# EAGLE design DIYTIL311_Programmer (EAGLE 9.4.2)
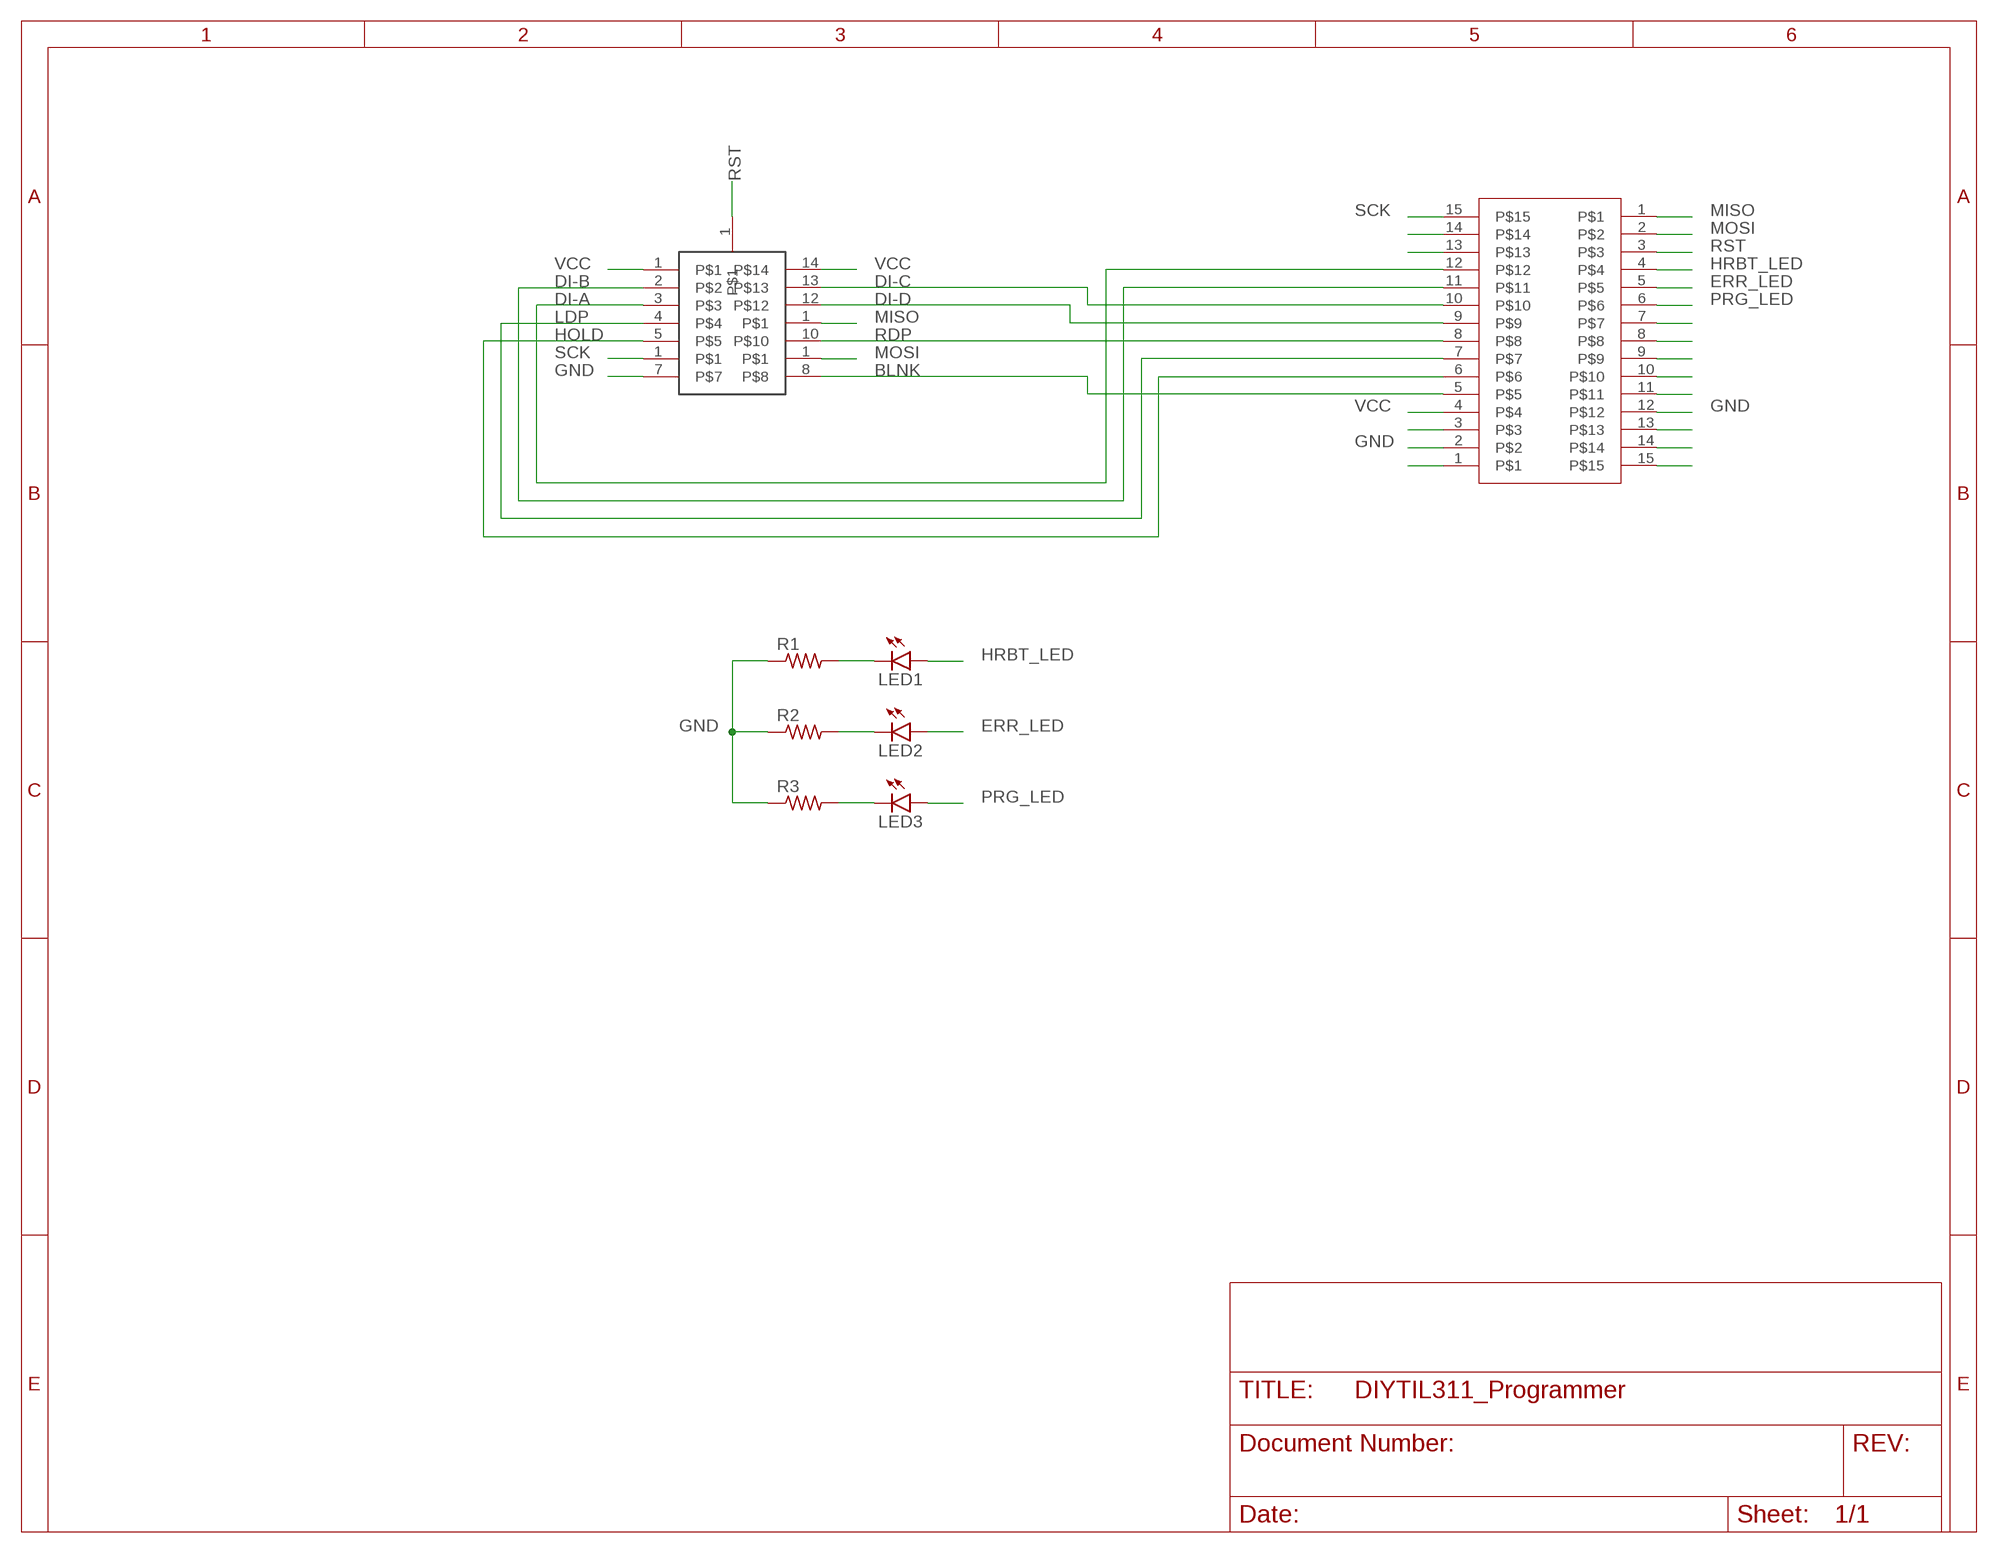
[diagram p0: schematic, sheet 1]

## Parts
LED1  LED5MM  [LED5MM]
LED2  LED5MM  [LED5MM]
LED3  LED5MM  [LED5MM]
MISO  1X1_2.54MM1X1  [1X1_2.54MM_FOOTPRINT]
MOSI  1X1_2.54MM1X1  [1X1_2.54MM_FOOTPRINT]
R1  R-US_0204/7  [0204/7]
R2  R-US_0204/7  [0204/7]
R3  R-US_0204/7  [0204/7]
RST  1X1_2.54MM1X1  [1X1_2.54MM_FOOTPRINT]
SCK  1X1_2.54MM1X1  [1X1_2.54MM_FOOTPRINT]
U$1  TIL311DIP  [TIL311DIP_FOOTPRINT]
U$2  1X15_2.54MM1X15_2.54MM  [1X15_2.54MM_FOOTPRINT]
U$3  1X15_2.54MM1X15_2.54MM  [1X15_2.54MM_FOOTPRINT]

## Nets
BLNK: U$1.8 U$2.5
DI-A: U$1.3 U$2.12
DI-B: U$1.2 U$2.11
DI-C: U$1.13 U$2.10
DI-D: U$1.12 U$2.9
ERR_LED: LED2.A U$3.5
GND: R1.1 R2.1 R3.1 U$1.7 U$2.2 U$3.12
HOLD: U$1.5 U$2.6
HRBT_LED: LED1.A U$3.4
LDP: U$1.4 U$2.7
MISO: MISO.1 U$3.1
MOSI: MOSI.1 U$3.2
N$1: LED1.K(C) R1.2
N$2: LED2.K(C) R2.2
N$4: LED3.K(C) R3.2
N$7: U$3.7
N$8: U$3.8
N$9: U$3.9
N$10: U$3.10
N$11: U$3.11
N$13: U$3.13
N$14: U$3.14
N$15: U$3.15
N$17: U$2.14
N$18: U$2.13
N$28: U$2.3
N$30: U$2.1
PRG_LED: LED3.A U$3.6
RDP: U$1.10 U$2.8
RST: RST.1 U$3.3
SCK: SCK.1 U$2.15
VCC: U$1.1 U$1.14 U$2.4

## Library data of the parts
LED1-LED3 = led:LED: LED OSRAM: - CHIPLED LG R971, LG N971, LY N971, LG Q971, LY Q971, LO R971, LY R971 LH N974, LH R974 LS Q976, LO Q976, LY Q976 LO Q996 - Hyper CHIPLED LW Q18S LB Q993, LB Q99A, LB R99A - SideLED LS A670, LO A670, LY A670, LG A670, LP A670 LB A673, LV A673, LT A673, LW A673 LH A674 LY A675 LS A676, LA A676, LO A676, LY A676, LW A676 LS A679, LY A679, LG A679 - Hyper Micro SIDELED® LS Y876, LA Y876, LO Y876, LY Y876 LT Y87S - SmartLED LW L88C, LW L88S LB L89C, LB L89S, LG L890 LS L89K, LO L89K, LY L89K LS L896, LA L896, LO L896, LY L896 - TOPLED LS T670, LO T670, LY T670, LG T670, LP T670 LSG T670, LSP T670, LSY T670, LOP T670, LYG T670 LG T671, LOG T671, LSG T671 LB T673, LV T673, LT T673, LW T673 LH T674 LS T676, LA T676, LO T676, LY T676, LB T676, LH T676, LSB T676, LW T676 LB T67C, LV T67C, LT T67C, LS T67K, LO T67K, LY T67K, LW E67C LS E67B, LA E67B, LO E67B, LY E67B, LB E67C, LV E67C, LT E67C LW T67C LS T679, LY T679, LG T679 LS T770, LO T770, LY T770, LG T770, LP T770 LB T773, LV T773, LT T773, LW T773 LH T774 LS E675, LA E675, LY E675, LS T675 LS T776, LA T776, LO T776, LY T776, LB T776 LHGB T686 LT T68C, LB T68C - Hyper Mini TOPLED® LB M676 - Mini TOPLED Santana® LG M470 LS M47K, LO M47K, LY M47K Source: http://www.osram.convergy.de LUXEON: - LUMILED® LXK2-PW12-R00, LXK2-PW12-S00, LXK2-PW14-U00, LXK2-PW14-V00 LXK2-PM12-R00, LXK2-PM12-S00, LXK2-PM14-U00 LXK2-PE12-Q00, LXK2-PE12-R00, LXK2-PE12-S00, LXK2-PE14-T00, LXK2-PE14-U00 LXK2-PB12-K00, LXK2-PB12-L00, LXK2-PB12-M00, LXK2-PB14-N00, LXK2-PB14-P00, LXK2-PB14-Q00 LXK2-PR12-L00, LXK2-PR12-M00, LXK2-PR14-Q00, LXK2-PR14-R00 LXK2-PD12-Q00, LXK2-PD12-R00, LXK2-PD12-S00 LXK2-PH12-R00, LXK2-PH12-S00 LXK2-PL12-P00, LXK2-PL12-Q00, LXK2-PL12-R00 Source: www.luxeon.com KINGBRIGHT: KA-3528ASYC Source: www.kingbright.com
MISO MOSI RST SCK = FUCK,_no_one_makes_is_so_I_might_as_well...:1X1_2.54MM
R1-R3 = rcl:R-US_: RESISTOR, American symbol; SPICEPREFIX: R
U$1 = FUCK,_no_one_makes_is_so_I_might_as_well...:TIL311DIP
U$2 U$3 = FUCK,_no_one_makes_is_so_I_might_as_well...:1X15_2.54MM

## Board
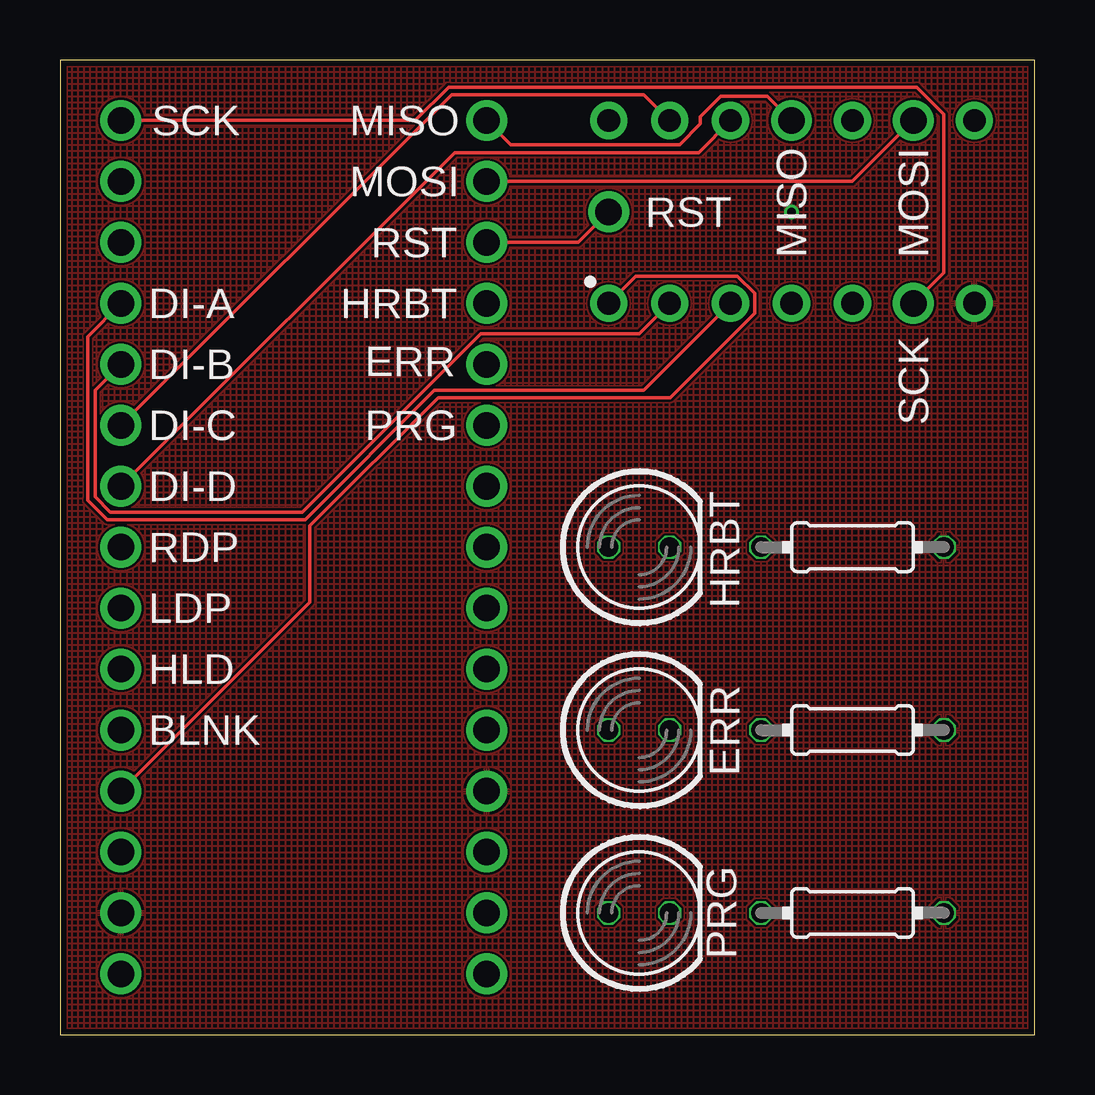
[diagram p1: board, top side]
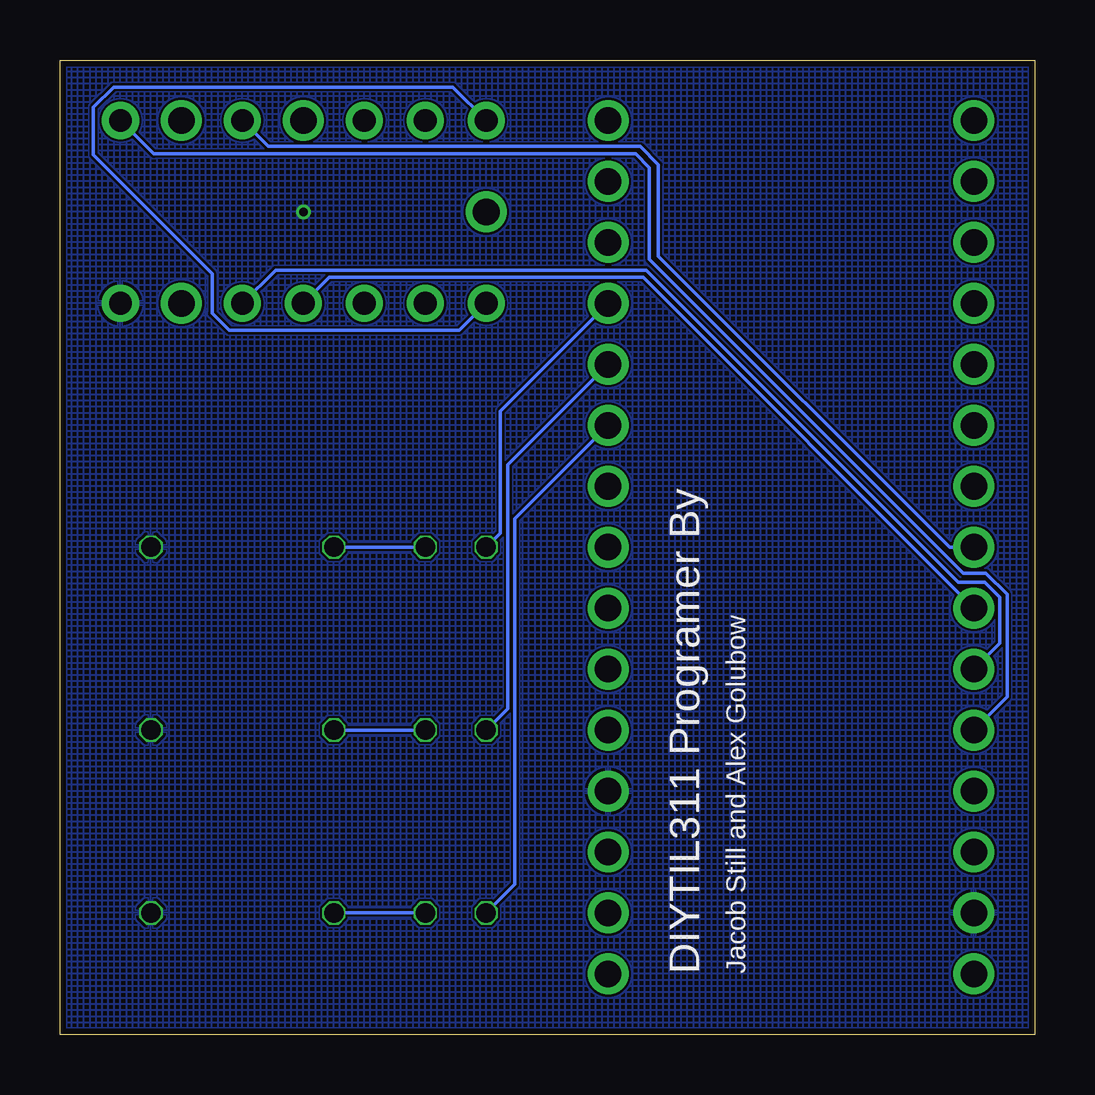
[diagram p2: board, bottom side, seen from below]

Size 40.62 x 40.62 mm. Coordinates in mm from the lower left corner, seen from the top.
Outline: 0,0 40.62,0 40.62,40.62 0,40.62 0,0
Copper layers (1*16): Top 0.035mm / dielectric 1.5mm / Bottom 0.035mm
Design rules "JLCPCB": minimum track width 3.5mil, minimum drill 0.2mm, track to track 3.5mil, track to pad 3.5mil, pad to pad 3.5mil, via to via 5mil, smd to smd 2mil, copper to edge 10mil, drill to drill 6mil, minimum pad ring 3mil, minimum via ring 5mil, stop-mask expansion 4mil, vias tented up to drill 0mil, thermal gap 5mil

### Footprints (pad centres in the part's own frame; a part is rotated, then mirrored left to right if it is on the bottom)
LED5MM = drill 0.813 octagon: A -1.27,0; K 1.27,0
1X1_2.54MM_FOOTPRINT = drill 1.105 pad 1.705: 1 0,0
0204/7 = drill 0.813 octagon: 1 -3.81,0; 2 3.81,0
TIL311DIP_FOOTPRINT = drill 0.95 pad 1.55: 1 -3.81,7.62; 2 -3.81,5.08; 3 -3.81,2.54; 4 -3.81,0; 5 -3.81,-2.54; 7 -3.81,-7.62; 8 3.81,-7.62; 10 3.81,-2.54; 12 3.81,2.54; 13 3.81,5.08; 14 3.81,7.62
1X15_2.54MM_FOOTPRINT = drill 1.105 pad 1.705: 1 0,0; 2 2.54,0; 3 5.08,0; 4 7.62,0; 5 10.16,0; 6 12.7,0; 7 15.24,0; 8 17.78,0; 9 20.32,0; 10 22.86,0; 11 25.4,0; 12 27.94,0; 13 30.48,0; 14 33.02,0; 15 35.56,0

### Placement (x,y rotation side)
LED1  24.13,20.32 0 top
LED2  24.13,12.7 0 top
LED3  24.13,5.08 0 top
MISO  30.48,38.1 0 top
MOSI  35.56,38.1 0 top
R1  33.02,20.32 180 top
R2  33.02,12.7 180 top
R3  33.02,5.08 180 top
RST  22.86,34.29 0 top
SCK  35.56,30.48 0 top
U$1  30.48,34.29 90 top
U$2  2.54,2.54 90 top
U$3  17.78,38.1 270 top

### Tracks (layer width: path | path; a pad name or v marks a point on that pad's centre or on a via)
BLNK
  Bottom 0.152: U$2.5 1.15,14.09 1.15,18.35 2.04,19.24 2.99,19.24 16.06,32.31 16.06,36.13 16.64,36.7 36.7,36.7 U$1.8
DI-A
  Top 0.152: U$2.12 1.15,29.09 1.15,22.29 1.97,21.47 10.22,21.47 15.6,26.86 24.32,26.86 U$1.3
DI-B
  Top 0.152: U$2.11 1.46,26.86 1.46,22.41 2.09,21.78 10.09,21.78 17.52,29.21 24.13,29.21 U$1.2
DI-C
  Top 0.152: U$1.13 24.32,39.18 16.32,39.18 U$2.10
DI-D
  Top 0.152: U$2.9 16.45,36.77 26.61,36.77 U$1.12
ERR_LED
  Bottom 0.152: LED2.A 21.97,13.59 21.97,23.75 U$3.5
GND  (via drill 0.35)
  other vias: 30.48,34.29
  pour Top (hatched): 0,0 40.64,0 40.64,40.64 0,40.64
  pour Bottom (hatched): 0,0 40.64,0 40.64,40.64 0,40.64
HOLD
  Bottom 0.152: U$1.5 31.63,31.87 16.2,31.87 3.19,18.86 2.09,18.86 1.46,18.23 1.46,16.32 U$2.6
HRBT_LED
  Bottom 0.152: U$3.4 22.28,25.98 22.28,20.9 LED1.A
LDP
  Bottom 0.152: U$1.4 29.4,31.56 16.32,31.56 U$2.7
MISO
  Top 0.152: U$3.1 18.78,37.1 25.82,37.1 26.68,37.96 26.68,38.26 27.52,39.1 29.48,39.1 MISO.1
MOSI
  Top 0.152: U$3.2 33.02,35.56 MOSI.1
N$1
  Bottom 0.152: LED1.K R1.2
N$2
  Bottom 0.152: LED2.K R2.2
N$4
  Bottom 0.152: LED3.K R3.2
PRG_LED
  Bottom 0.152: U$3.6 21.67,21.51 21.67,6.27 LED3.A
RDP
  Bottom 0.152: U$2.8 3.56,20.32 15.68,32.45 15.68,36.26 16.44,37.02 31.94,37.02 U$1.10
RST
  Top 0.152: U$3.3 21.59,33.02 RST.1
SCK
  Top 0.152: U$2.15 14.81,38.1 16.2,39.49 35.7,39.49 36.83,38.36 36.83,31.75 SCK.1
VCC
  Top 0.152: U$2.4 10.41,18.03 10.41,21.21 15.75,26.55 25.43,26.55 28.94,30.06 28.94,30.9 28.23,31.61 23.99,31.61 U$1.1
  Bottom 0.152: U$1.1 23.99,29.35 33.56,29.35 34.28,30.06 34.28,31.71 39.23,36.67 39.23,38.64 38.39,39.49 24.25,39.49 U$1.14

### Text on the board
tPlace: SCK | MISO | MOSI | RST | RST | MISO | MOSI | DI-A | HRBT | DI-B | ERR | DI-C | PRG | SCK | DI-D | RDP | HRBT | LDP | HLD | BLNK | ERR | PRG
bPlace: Jacob Still and Alex Golubow | DIYTIL311 Programer By